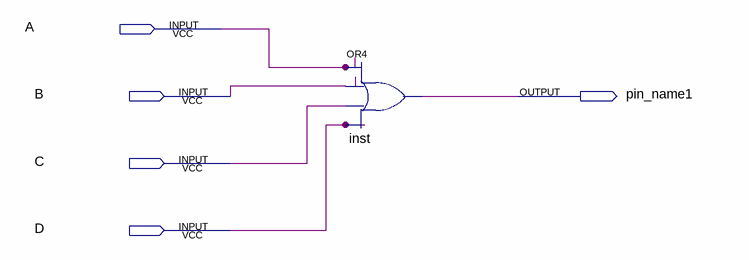
[diagram p0: schematic sheet]
// Quartus schematic mux21_a.bdf as structural Verilog: 1 symbols, 5 pins
module mux21_a (
  input  A,
  input  B,
  input  C,
  input  D,
  output pin_name1
);

  or inst (pin_name1, A, B, C, D);
endmodule
